# EAGLE schematic led-er-breakout (EAGLE 7.2.0)
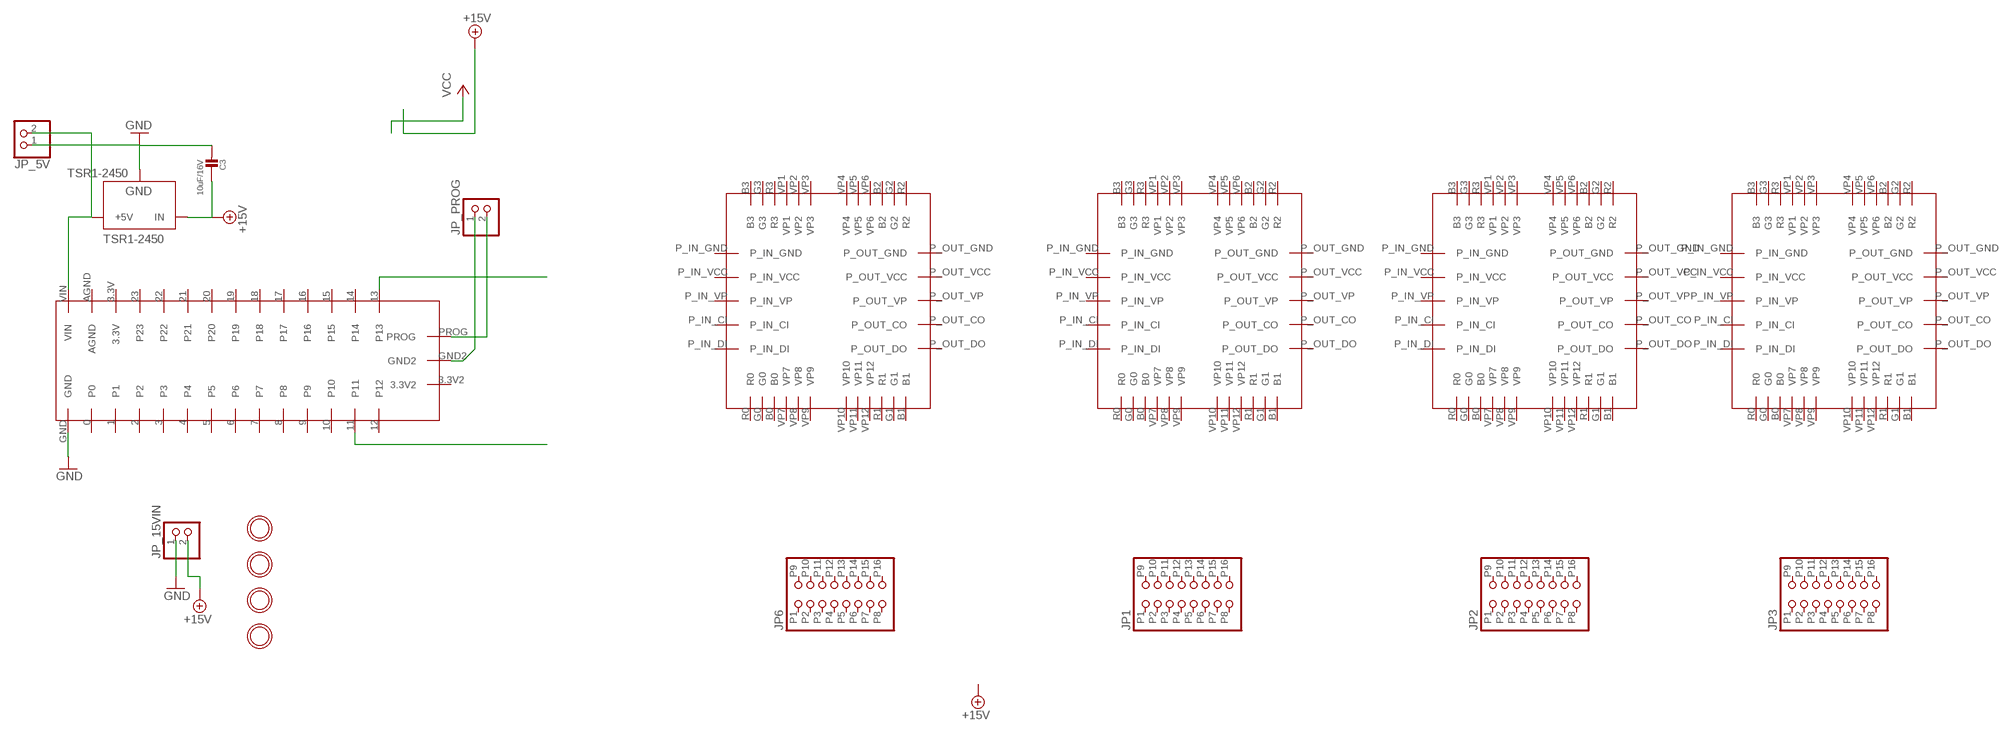
[diagram p0: schematic, sheet 1]

## Parts
C3  10uF/16V  CAP_CERAMIC0805  [0805]
JP1  HEADER-2X8  [2X08]
JP2  HEADER-2X8  [2X08]
JP3  HEADER-2X8  [2X08]
JP6  HEADER-2X8  [2X08]
JP_5V  HEADER-1X2  [1X02_OVAL]
JP_15VIN  HEADER-1X2  [1X02_OVAL]
JP_PROG  HEADER-1X2  [1X02_OVAL]
TSR1-2450  TSR1-2450  [TSR-1]
U$1  MOUNTINGHOLE  [MOUNTINGHOLE_3.0_PLATED]
U$2  MOUNTINGHOLE  [MOUNTINGHOLE_3.0_PLATED]
U$3  MOUNTINGHOLE  [MOUNTINGHOLE_3.0_PLATED]
U$4  MOUNTINGHOLE  [MOUNTINGHOLE_3.0_PLATED]
U$5  TEENSY_LEDER  [TEENSY_LEDER]
U$6  TLC59711_BREAKOUT  [TLC59711_BREAKOUT]
U$7  TLC59711_BREAKOUT  [TLC59711_BREAKOUT]
U$8  TLC59711_BREAKOUT  [TLC59711_BREAKOUT]
U$9  TLC59711_BREAKOUT  [TLC59711_BREAKOUT]

## Nets
+15V: C3.1 JP_15VIN.2 TSR1-2450.1(IN)
GND: C3.2 JP_5V.1 JP_15VIN.1 TSR1-2450.2(GND)
JP1: JP_5V.2 TSR1-2450.3(+5V) U$5.VIN
N$54: JP_PROG.1 U$5.GND2
N$55: JP_PROG.2 U$5.PROG
SCKI: U$5.13
SDTI: U$5.11
Unconnected: JP1.P1 JP1.P2 JP1.P3 JP1.P4 JP1.P5 JP1.P6 JP1.P7 JP1.P8 JP1.P9 JP1.P10 JP1.P11 JP1.P12 JP1.P13 JP1.P14 JP1.P15 JP1.P16 JP2.P1 JP2.P2 JP2.P3 JP2.P4 JP2.P5 JP2.P6 JP2.P7 JP2.P8 JP2.P9 JP2.P10 JP2.P11 JP2.P12 JP2.P13 JP2.P14 JP2.P15 JP2.P16 JP3.P1 JP3.P2 JP3.P3 JP3.P4 JP3.P5 JP3.P6 JP3.P7 JP3.P8 JP3.P9 JP3.P10 JP3.P11 JP3.P12 JP3.P13 JP3.P14 JP3.P15 JP3.P16 JP6.P1 JP6.P2 JP6.P3 JP6.P4 JP6.P5 JP6.P6 JP6.P7 JP6.P8 JP6.P9 JP6.P10 JP6.P11 JP6.P12 JP6.P13 JP6.P14 JP6.P15 JP6.P16 U$5.0 U$5.1 U$5.2 U$5.3 U$5.3.3V U$5.3.3V2 U$5.4 U$5.5 U$5.6 U$5.7 U$5.8 U$5.9 U$5.10 U$5.12 U$5.14 U$5.15 U$5.16 U$5.17 U$5.18 U$5.19 U$5.20 U$5.21 U$5.22 U$5.23 U$5.AGND U$5.GND U$6.B0 U$6.B1 U$6.B2 U$6.B3 U$6.G0 U$6.G1 U$6.G2 U$6.G3 U$6.P_IN_CI U$6.P_IN_DI U$6.P_IN_GND U$6.P_IN_VCC U$6.P_IN_VP U$6.P_OUT_CO U$6.P_OUT_DO U$6.P_OUT_GND U$6.P_OUT_VCC U$6.P_OUT_VP U$6.R0 U$6.R1 U$6.R2 U$6.R3 U$6.VP1 U$6.VP2 U$6.VP3 U$6.VP4 U$6.VP5 U$6.VP6 U$6.VP7 U$6.VP8 U$6.VP9 U$6.VP10 U$6.VP11 U$6.VP12 U$7.B0 U$7.B1 U$7.B2 U$7.B3 U$7.G0 U$7.G1 U$7.G2 U$7.G3 U$7.P_IN_CI U$7.P_IN_DI U$7.P_IN_GND U$7.P_IN_VCC U$7.P_IN_VP U$7.P_OUT_CO U$7.P_OUT_DO U$7.P_OUT_GND U$7.P_OUT_VCC U$7.P_OUT_VP U$7.R0 U$7.R1 U$7.R2 U$7.R3 U$7.VP1 U$7.VP2 U$7.VP3 U$7.VP4 U$7.VP5 U$7.VP6 U$7.VP7 U$7.VP8 U$7.VP9 U$7.VP10 U$7.VP11 U$7.VP12 U$8.B0 U$8.B1 U$8.B2 U$8.B3 U$8.G0 U$8.G1 U$8.G2 U$8.G3 U$8.P_IN_CI U$8.P_IN_DI U$8.P_IN_GND U$8.P_IN_VCC U$8.P_IN_VP U$8.P_OUT_CO U$8.P_OUT_DO U$8.P_OUT_GND U$8.P_OUT_VCC U$8.P_OUT_VP U$8.R0 U$8.R1 U$8.R2 U$8.R3 U$8.VP1 U$8.VP2 U$8.VP3 U$8.VP4 U$8.VP5 U$8.VP6 U$8.VP7 U$8.VP8 U$8.VP9 U$8.VP10 U$8.VP11 U$8.VP12 U$9.B0 U$9.B1 U$9.B2 U$9.B3 U$9.G0 U$9.G1 U$9.G2 U$9.G3 U$9.P_IN_CI U$9.P_IN_DI U$9.P_IN_GND U$9.P_IN_VCC U$9.P_IN_VP U$9.P_OUT_CO U$9.P_OUT_DO U$9.P_OUT_GND U$9.P_OUT_VCC U$9.P_OUT_VP U$9.R0 U$9.R1 U$9.R2 U$9.R3 U$9.VP1 U$9.VP2 U$9.VP3 U$9.VP4 U$9.VP5 U$9.VP6 U$9.VP7 U$9.VP8 U$9.VP9 U$9.VP10 U$9.VP11 U$9.VP12

## Library data of the parts
C3 = microbuilder:CAP_CERAMIC: Ceramic Capacitors For new designs, use the packages preceded by an '_' character since they are more reliable: The following footprints should be used on most boards: _0402 - Standard footprint for regular board layouts _0603 - Standard footprint for regular board layouts _0805 - Standard footprint for regular board layouts For extremely tight-pitch boards where space is at a premium, the following 'micro-pitch' footprints can be used (smaller pads, no silkscreen outline, etc.): _0402MP - Micro-pitch footprint for very dense/compact boards _0603MP - Micro-pitch footprint for very dense/compact boards _0805MP - Micro-pitch footprint for very dense/compact boards Commonly Stocked Parts 0402 - 0402 Surface Mount Capacitors 16pF 50V 5% [Digikey: 445-4899-2-ND] 18pF 50V 5% [Digikey: 490-1281-2-ND] 22pF 50V 5% [Digikey: 490-1283-2-ND] 68pF 50V 5% [Digikey: 490-1289-2-ND] 0.1uF 10V 10% [Digikey: 490-1318-2-ND] 1.0uF 6.3V 10% [Digikey: 490-1320-2-ND] 0603 - 0603 Surface Mount Capacitors 16 pF 50V 5% [Digikey: 445-5051-2-ND] 22 pF 50V [Digikey: PCC220ACVTR-ND] 33 pF 50V 5% [Digikey: 490-1415-1-ND] 56pF 50V 5% [Digikey: 490-1421-1-ND] 220pF 50V 5% [Digikey: 445-1285-1-ND] 680 pF 50V 2200 pF 50V 5% C0G [Digikey: 445-1297-1-ND] 5600 pF 100V 5% X7R [Digikey: 478-3711-1-ND] 0.1 µF 25V 10% [Digikey: PCC2277TR-ND] 0.22 µF 16V 10% X7R [Digikey: 445-1318-1-ND] 1.0 µF 25V 10% [Digikey: 445-5146-2-ND] 0603 - RF Specific 3pF 250V +/-0.1pF RF [Digikey: 712-1347-1-ND] 18 pF 250V 5% [Digikey: 478-3505-1-ND or 712-1322-1-ND] 56 pF 250V 5% C0G RF [Digikey: 490-4867-1-ND] 68 pF 250V RF [Digikey: 490-4868-1-ND] 0805 - 0805 Surface Mount Capacitors 220 pF 250V 2% RF Ceramic Capacitor [Digikey: 712-1398-1-ND] 1000 pF 50V 2% NP0 Ceramic Capacitor [Digikey: 478-3760-1-ND] 0.1 µF 25V 10% Ceramic Capacitor [Digikey: PCC1828TR-ND] 1.0 µF 16V 10% Ceramic Capacitor[Digikey: 490-1691-2-ND] 10.0 µF 10V 10% Ceramic Capacitor[Digikey: 709-1228-1-ND] 10.0 uF 16V 10% Ceramic Capacitor [Digikey: 478-5165-2-ND] 47 uF 6.3V 20% Ceramic Capacitor [Digikey: 587-1779-1-ND or 399-5506-1-ND] 1206 - 1206 Surface Mount Capacitors 47uF 10V 20% Ceramic Capacitor [Digikey: 490-5528-1-ND or 399-5508-1-ND or 445-6010-1-ND] 100uF 6.3V -20%, +80% Y5V Ceramic Capacitor (Digikey: 490-4512-1-ND, Mouser: 81-GRM31CF50J107ZE1L)
JP1-JP3 JP6 = Andrews:HEADER-2X8: 2x8 shrouded header
JP_5V JP_15VIN JP_PROG = microbuilder:HEADER-1X2: PIN HEADER
TSR1-2450 = SteelCaveRobotics-Power:TSR1-2450: Traco Power TSR 1-2450 5.0v switching regulator
U$1-U$4 = microbuilder:MOUNTINGHOLE: Mounting Hole For #2 screws (0.086"/2.18mm width, 0.094"/2.4mm hole) use 2.5mm
U$5 = Andrews:TEENSY_LEDER
U$6-U$9 = Andrews:TLC59711_BREAKOUT: Adafruit TLC59711 breakout board footprint